# Altium schematic sheet DistanceSensor.SchDoc
size A; SheetNumber: 8
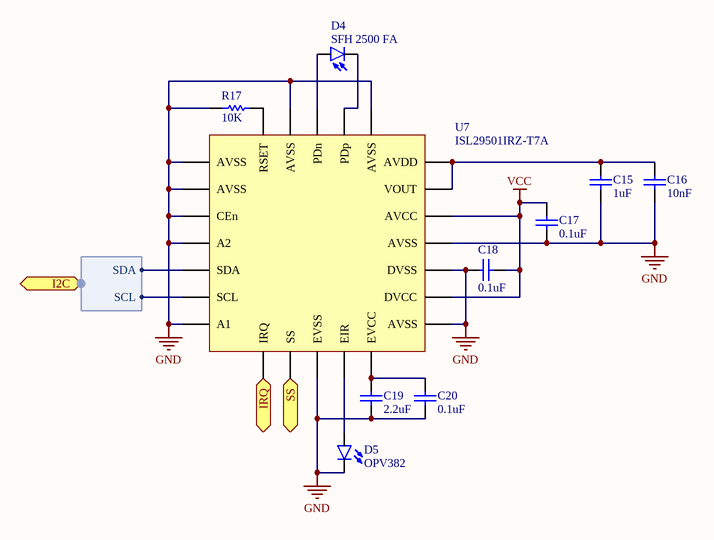
[diagram p0: DistanceSensor.SchDoc]

## Parts
C15  value 1uF  [C0402[1005X55]]  (hidden comment: 1uF 6.3V 0402)
C16  value 10nF  [C0402[1005X55]]  (hidden comment: 10nF 50V 0402)
C17  value 0.1uF  [C0402[1005X55]]  (hidden comment: 0.1uF 6.3V 0402)
C18  value 0.1uF  [C0402[1005X55]]  (hidden comment: 0.1uF 6.3V 0402)
C19  value 2.2uF  [C0402[1005X55]]  (hidden comment: 2.2uF 6.3V 0402)
C20  value 0.1uF  [C0402[1005X55]]  (hidden comment: 0.1uF 6.3V 0402)
D4  SFH 2500 FA  [SFH 2500 FA]
D5  OPV382  [OPV382]
R17  value 10K  [R0402[1005]]  (hidden comment: 10K 1% 0402)
U7  ISL29501IRZ-T7A  [QFN-24]

## Ports
I2C (harness I2C), IRQ (out), SS (in)

## Harnesses
I2C: SCL, SDA

## Nets
GND: C15.1 C16.1 C17.2 C18.2 C19.1 C20.1 D5.1(C) R17.1 U7.1(AVSS) U7.2(AVSS) U7.3(CEn) U7.4(A2) U7.7(A1) U7.10(EVSS) U7.13(AVSS) U7.15(DVSS) U7.16(AVSS) U7.20(AVSS) U7.23(AVSS)
VCC: C17.1 C18.1 U7.14(DVCC) U7.17(AVCC)
IRQ: U7.8(IRQ) ; port IRQ
SS: U7.9(SS) ; port SS
NetC15_2: C15.2 C16.2 U7.18(VOUT) U7.19(AVDD)
NetC19_2: C19.2 C20.2 U7.12(EVCC)
NetD4_1: D4.1(C) U7.21(PDp)
NetD4_2: D4.2(A) U7.22(PDn)
NetD5_2: D5.2(A) U7.11(EIR)
NetR17_2: R17.2 U7.24(RSET)
NetU7_5: U7.5(SDA) ; port I2C.SDA
NetU7_6: U7.6(SCL) ; port I2C.SCL

## Library data of the parts
C15 = CAP_1uF_6.3V_0402_10%: 1uF 6.3V 10% 0402 (1005 Metric); PartNumber: GRM155R70J105KA12D; Manufacturer: Murata; Mounting Technology: Surface Mount; PackageReference: 0402; PackageDescription: 0402 (1005 Metric); Voltage: 6.3V; Tolerance: 10%
C16 = CAP_10nF_50V_0402_10%: 10nF 50V 10% 0402 (1005 Metric); PartNumber: GCM155R71H103KA55D; Manufacturer: Murata; Mounting Technology: Surface Mount; PackageReference: 0402; PackageDescription: 0402 (1005 Metric); Voltage: 50V; Tolerance: 10%
C17 C18 C20 = CAP_0.1uF_6.3V_0402_10%: 0.1uF 6.3V 10% 0402 (1005 Metric); PartNumber: GRM155R70J104KA01D; Manufacturer: Murata; Mounting Technology: Surface Mount; PackageReference: 0402; PackageDescription: 0402 (1005 Metric); Voltage: 6.3V; Tolerance: 10%
C19 = CAP_2.2uF_6.3V_0402_20%: 2.2uF 6.3V 20% 0402 (1005 Metric); PartNumber: GRM155R60J225ME15D; Manufacturer: Murata; Mounting Technology: Surface Mount; PackageReference: 0402; PackageDescription: 0402 (1005 Metric); Voltage: 6.3V; Tolerance: 20%
D4 = SFH 2500 FA: Manufacturer: Osram; PartNumber: SFH 2500 FA; Mounting Technology: Surface Mount
D5 = OPV382: Manufacturer: OPTEK Technology; PartNumber: OPV382; Mounting Technology: Through Hole
R17 = RES_10K_0402_1%: 10K 0.063W 1% 0402 (1005 Metric); Manufacturer: KOA Speer; PartNumber: RK73H1ETTP1002F; Tolerance: 1%; Power: 0.063W; Mounting Technology: Surface Mount; PackageReference: 0402; PackageDescription: 0402 (1005 Metric); ComponentLink1Description: Datasheet; ComponentLink1URL: http://www.koaspeer.com/catimages/Products/RK73H/RK73H.pdf
U7 = ISL29501IRZ-T7A: IC TOF SIGNAL PROCESSOR 24QFN; pin to pad: 23>23+25; Manufacturer: Intersil; PartNumber: ISL29501IRZ-T7A; Mounting Technology: Surface Mount; PackageReference: QFN-24